# Altium schematic sheet Overview.SchDoc
size 297 x 209 mm; SheetNumber: 1; SheetTotal: 5
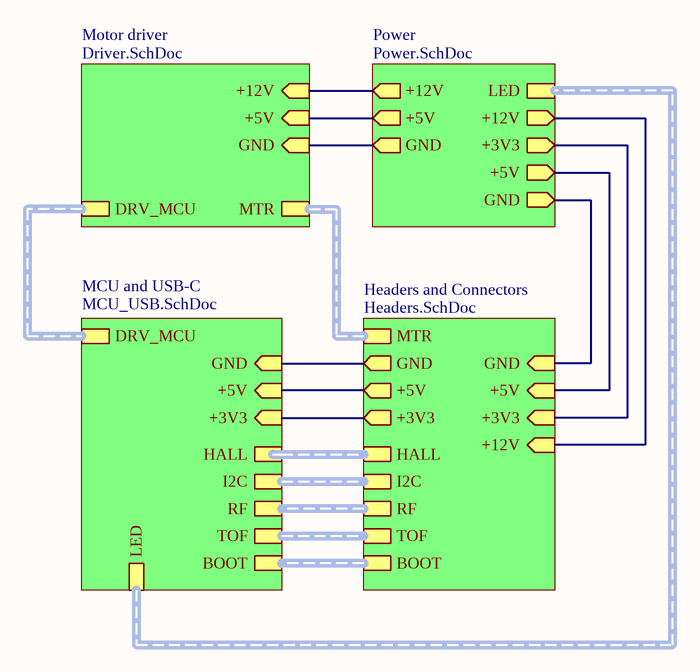
[diagram p0: Overview.SchDoc]

## Sub-sheets
Headers and Connectors = Headers.SchDoc: +3V3 (in), GND (in), +5V (in), MTR, +3V3 (out), +5V (out), GND (out), HALL, I2C, RF, TOF, BOOT, +12V (in)
MCU and USB-C = MCU_USB.SchDoc: +3V3 (in), GND (in), +5V (in), DRV_MCU, HALL, I2C, RF, TOF, BOOT, LED
Motor driver = Driver.SchDoc: +12V (in), +5V (in), GND (in), MTR, DRV_MCU
Power = Power.SchDoc: +12V (out), +3V3 (out), GND (out), GND (out), +5V (out), +5V (out), LED, +12V (out)

## Nets
(unnamed): sheet Motor driver/+12V, sheet Power/+12V
(unnamed): sheet Motor driver/+5V, sheet Power/+5V
(unnamed): sheet Motor driver/GND, sheet Power/GND
(unnamed): sheet Power/+3V3, sheet Headers and Connectors/+3V3
(unnamed): sheet Power/GND, sheet Headers and Connectors/GND
(unnamed): sheet Power/+5V, sheet Headers and Connectors/+5V
(unnamed): sheet Power/+12V, sheet Headers and Connectors/+12V
(unnamed): sheet MCU and USB-C/+3V3, sheet Headers and Connectors/+3V3
(unnamed): sheet MCU and USB-C/GND, sheet Headers and Connectors/GND
(unnamed): sheet MCU and USB-C/+5V, sheet Headers and Connectors/+5V

## Buses and harness runs
harness sheet Headers and Connectors/BOOT = sheet MCU and USB-C/BOOT
harness sheet Headers and Connectors/HALL = sheet MCU and USB-C/HALL
harness sheet Headers and Connectors/I2C = sheet MCU and USB-C/I2C
harness sheet Headers and Connectors/MTR = sheet Motor driver/MTR
harness sheet Headers and Connectors/RF = sheet MCU and USB-C/RF
harness sheet Headers and Connectors/TOF = sheet MCU and USB-C/TOF
harness sheet MCU and USB-C/DRV_MCU = sheet Motor driver/DRV_MCU
harness sheet MCU and USB-C/LED = sheet Power/LED

## Notes on the sheet
- THIS DOCUMENT AND THE DATA DISCLOSED HEREIN OR
- HEREWITH IS THE PROPERTY OF ALTIUM LIMITED AND MAY
- DWG NO:
- REVISION
- REV:
- DESCRIPTION
- DATE
- APPROVED
- BE FREELY DISTRIBUTED IN WHOLE. NO RIGHTS ARE
- RESERVED OR EXPRESS OR IMPLIED WARANTEE GIVEN.
- ENG:
- APPROVALS
- PROJECT
- DSN:
- CHK:
- REFERENCE DOCUMENTS
- PROJECT REVISION:
- TITLE
- DOCUMENT REVISION:
- DESIGN ITEM:
- BOM:
- FAB DWG:
- PCB DWG:
- ASSY DWG:
- SCALE:
- A3
- SIZE
- CAGE CODE
- FILE NAME
- DWG NO.
- SHEET
- OF
- REV